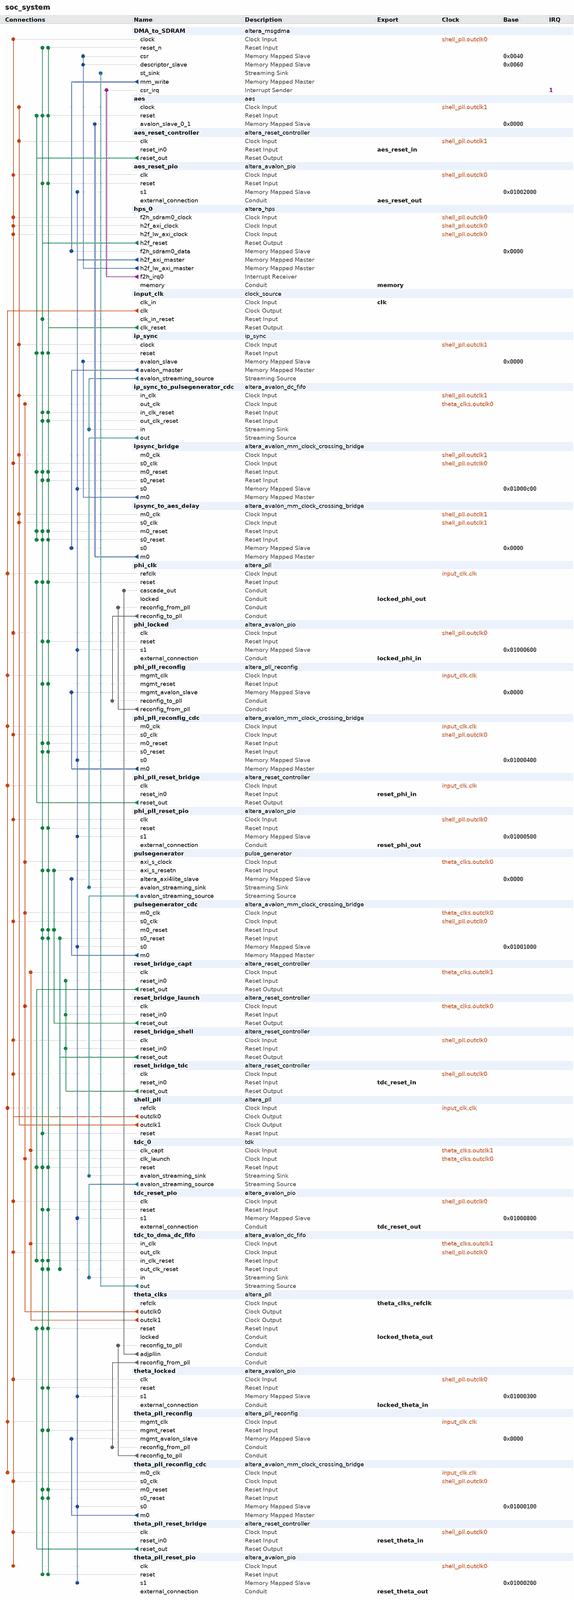
[diagram p0: system contents, whole]
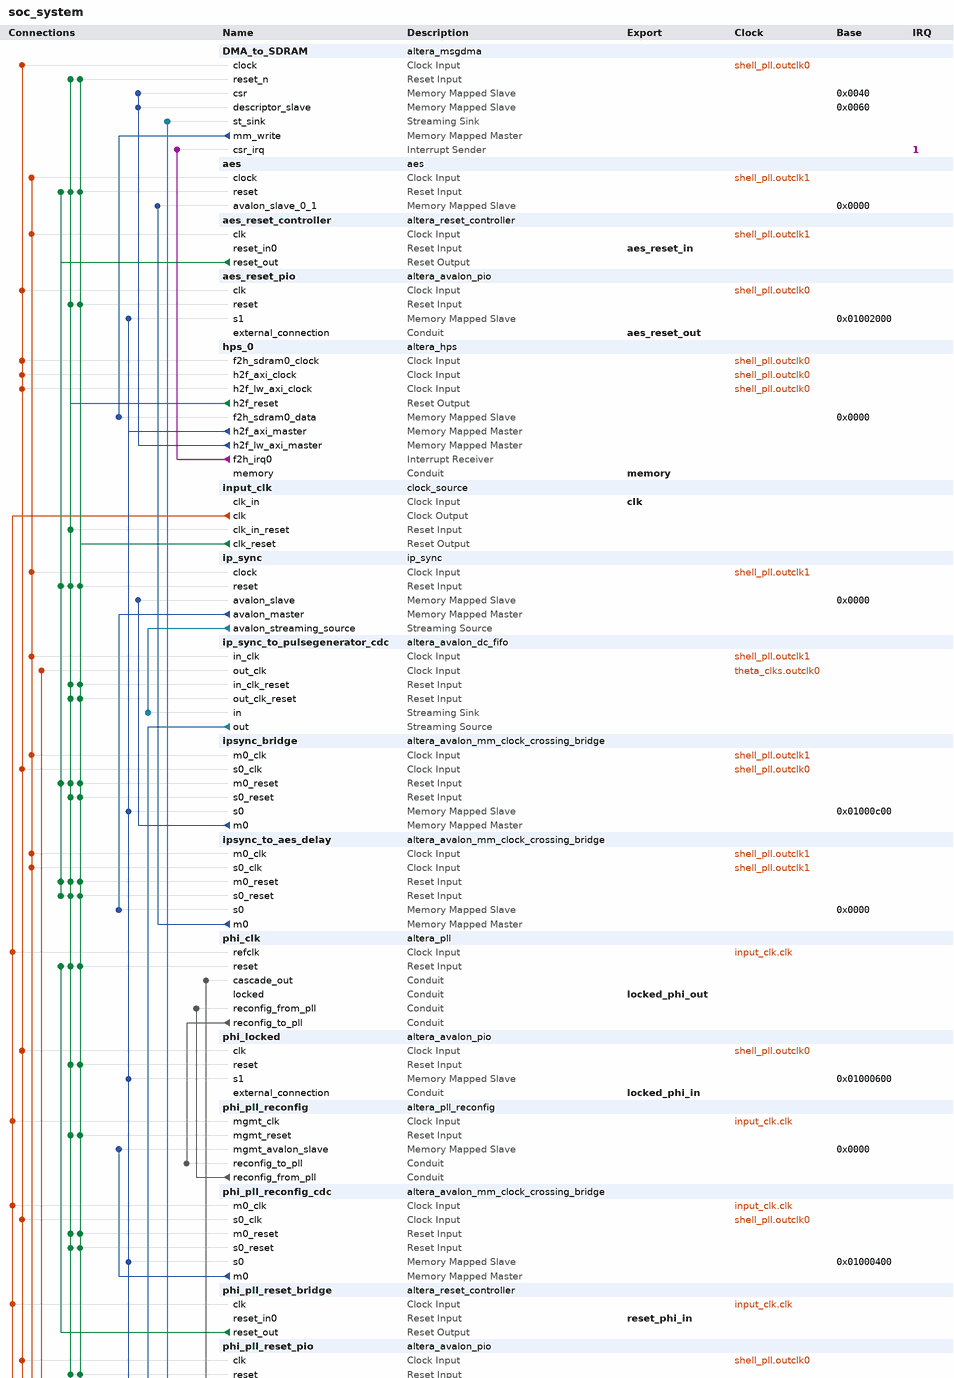
[diagram p1: system contents, upper part]
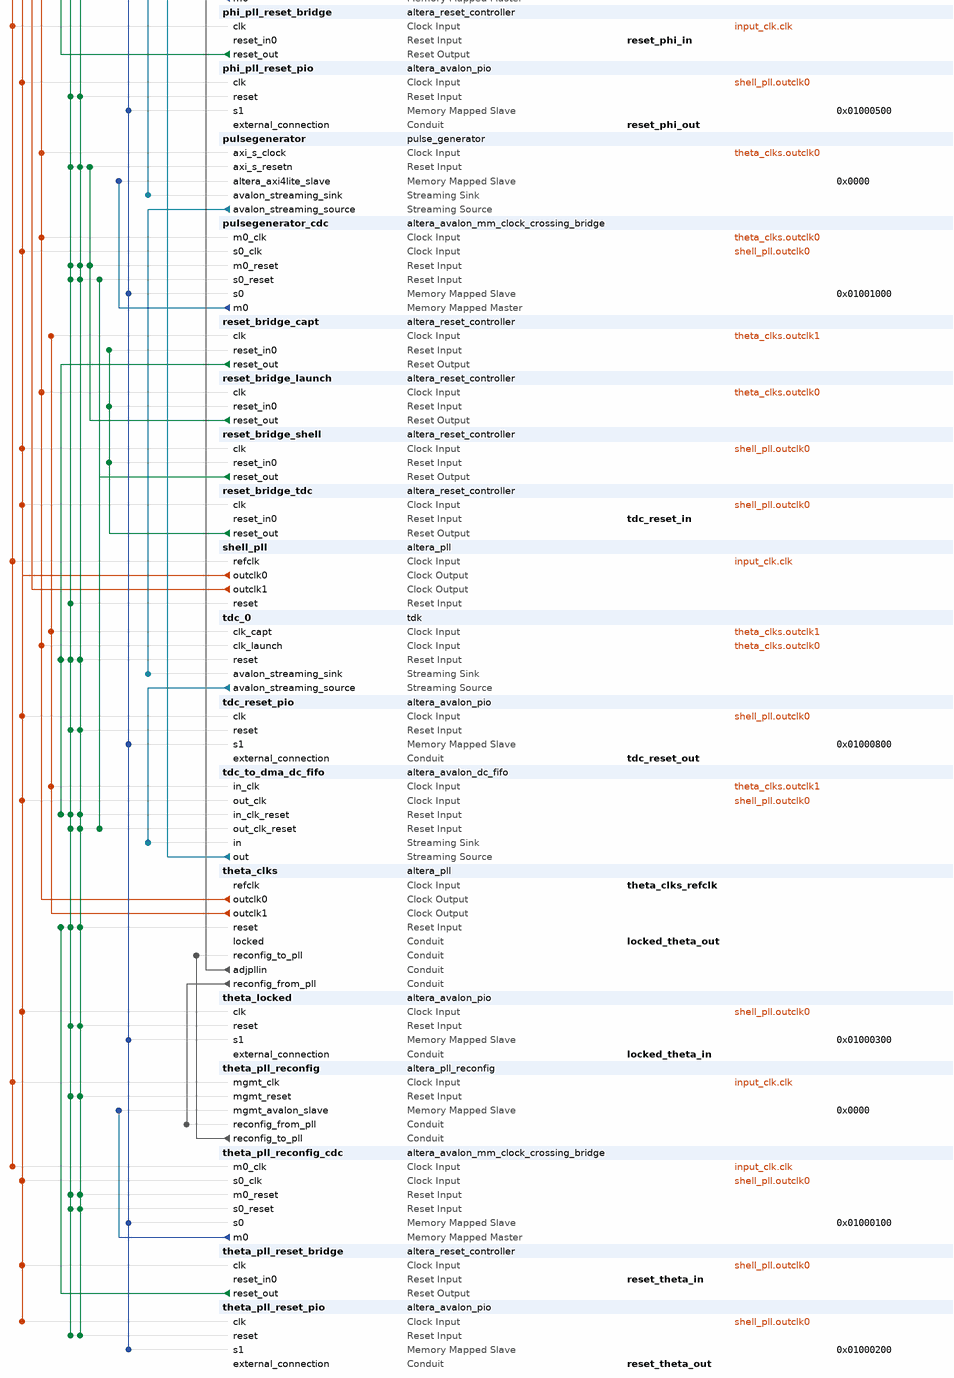
[diagram p2: system contents, lower part]
# Platform Designer (Qsys) system soc_system, Cyclone V 5CSEBA6U23I7
# Parameters at their usual value, and those the tool derives, are not listed.
package require -exact qsys 22.1
create_system soc_system
set_project_property DEVICE_FAMILY {Cyclone V}
set_project_property DEVICE 5CSEBA6U23I7

add_instance DMA_to_SDRAM altera_msgdma 22.1
set_instance_parameter_value DMA_to_SDRAM BURST_ENABLE 1
set_instance_parameter_value DMA_to_SDRAM BURST_WRAPPING_SUPPORT 1
set_instance_parameter_value DMA_to_SDRAM DATA_FIFO_DEPTH 2048
set_instance_parameter_value DMA_to_SDRAM DATA_WIDTH 256
set_instance_parameter_value DMA_to_SDRAM DESCRIPTOR_FIFO_DEPTH 32
set_instance_parameter_value DMA_to_SDRAM ENHANCED_FEATURES 0
set_instance_parameter_value DMA_to_SDRAM ERROR_ENABLE 0
set_instance_parameter_value DMA_to_SDRAM MAX_BURST_COUNT 8
set_instance_parameter_value DMA_to_SDRAM MAX_BYTE 65536
set_instance_parameter_value DMA_to_SDRAM MODE 2
set_instance_parameter_value DMA_to_SDRAM PACKET_ENABLE 0
set_instance_parameter_value DMA_to_SDRAM TRANSFER_TYPE {Full Word Accesses Only}

add_instance aes aes 1.0

add_instance aes_reset_controller altera_reset_controller 22.1
set_instance_parameter_value aes_reset_controller NUM_RESET_INPUTS 1
set_instance_parameter_value aes_reset_controller SYNC_DEPTH 2

add_instance aes_reset_pio altera_avalon_pio 22.1
set_instance_parameter_value aes_reset_pio direction Output
set_instance_parameter_value aes_reset_pio width 32

add_instance hps_0 altera_hps 22.1
set_instance_parameter_value hps_0 EMAC1_Mode N/A
set_instance_parameter_value hps_0 EMAC1_PinMuxing Unused
set_instance_parameter_value hps_0 F2SCLK_COLDRST_Enable false
set_instance_parameter_value hps_0 F2SCLK_DBGRST_Enable false
set_instance_parameter_value hps_0 F2SCLK_WARMRST_Enable false
set_instance_parameter_value hps_0 F2SDRAM_Type {Avalon-MM Write-Only}
set_instance_parameter_value hps_0 F2SDRAM_Width 256
set_instance_parameter_value hps_0 F2SINTERRUPT_Enable true
set_instance_parameter_value hps_0 F2S_Width 0
set_instance_parameter_value hps_0 FPGA_PERIPHERAL_OUTPUT_CLOCK_FREQ_EMAC0_GTX_CLK 100
set_instance_parameter_value hps_0 FPGA_PERIPHERAL_OUTPUT_CLOCK_FREQ_EMAC0_MD_CLK 100.0
set_instance_parameter_value hps_0 FPGA_PERIPHERAL_OUTPUT_CLOCK_FREQ_EMAC1_GTX_CLK 100
set_instance_parameter_value hps_0 FPGA_PERIPHERAL_OUTPUT_CLOCK_FREQ_EMAC1_MD_CLK 100.0
set_instance_parameter_value hps_0 HPS_PROTOCOL DDR3
set_instance_parameter_value hps_0 I2C0_Mode N/A
set_instance_parameter_value hps_0 I2C0_PinMuxing Unused
set_instance_parameter_value hps_0 I2C1_Mode N/A
set_instance_parameter_value hps_0 I2C1_PinMuxing Unused
set_instance_parameter_value hps_0 LWH2F_Enable true
set_instance_parameter_value hps_0 MEM_BANKADDR_WIDTH 3
set_instance_parameter_value hps_0 MEM_CLK_FREQ 400.0
set_instance_parameter_value hps_0 MEM_COL_ADDR_WIDTH 10
set_instance_parameter_value hps_0 MEM_DQ_WIDTH 32
set_instance_parameter_value hps_0 MEM_DRV_STR RZQ/6
set_instance_parameter_value hps_0 MEM_ROW_ADDR_WIDTH 15
set_instance_parameter_value hps_0 MEM_RTT_NOM RZQ/6
set_instance_parameter_value hps_0 MEM_RTT_WR {Dynamic ODT off}
set_instance_parameter_value hps_0 MEM_TCL 7
set_instance_parameter_value hps_0 MEM_TFAW_NS 37.5
set_instance_parameter_value hps_0 MEM_TRAS_NS 35.0
set_instance_parameter_value hps_0 MEM_TRCD_NS 13.75
set_instance_parameter_value hps_0 MEM_TRFC_NS 300.0
set_instance_parameter_value hps_0 MEM_TRP_NS 13.75
set_instance_parameter_value hps_0 MEM_VENDOR Other
set_instance_parameter_value hps_0 MEM_WTCL 7
set_instance_parameter_value hps_0 QSPI_Mode N/A
set_instance_parameter_value hps_0 QSPI_PinMuxing Unused
set_instance_parameter_value hps_0 REF_CLK_FREQ 25.0
set_instance_parameter_value hps_0 S2FCLK_USER2CLK 4
set_instance_parameter_value hps_0 S2F_Width 1
set_instance_parameter_value hps_0 SDIO_Mode N/A
set_instance_parameter_value hps_0 SDIO_PinMuxing Unused
set_instance_parameter_value hps_0 SPIM1_Mode N/A
set_instance_parameter_value hps_0 SPIM1_PinMuxing Unused
set_instance_parameter_value hps_0 STM_Enable false
set_instance_parameter_value hps_0 TIMING_BOARD_AC_SKEW 0.02
set_instance_parameter_value hps_0 TIMING_BOARD_AC_TO_CK_SKEW 0.0
set_instance_parameter_value hps_0 TIMING_BOARD_DQ_TO_DQS_SKEW 0.0
set_instance_parameter_value hps_0 TIMING_BOARD_MAX_CK_DELAY 0.6
set_instance_parameter_value hps_0 TIMING_BOARD_MAX_DQS_DELAY 0.6
set_instance_parameter_value hps_0 TIMING_BOARD_SKEW_BETWEEN_DQS 0.02
set_instance_parameter_value hps_0 TIMING_BOARD_SKEW_CKDQS_DIMM_MAX 0.01
set_instance_parameter_value hps_0 TIMING_BOARD_SKEW_CKDQS_DIMM_MIN -0.01
set_instance_parameter_value hps_0 TIMING_BOARD_SKEW_WITHIN_DQS 0.02
set_instance_parameter_value hps_0 TIMING_TDH 125
set_instance_parameter_value hps_0 TIMING_TDQSCK 400
set_instance_parameter_value hps_0 TIMING_TDQSQ 120
set_instance_parameter_value hps_0 TIMING_TDS 50
set_instance_parameter_value hps_0 TIMING_TIH 250
set_instance_parameter_value hps_0 TIMING_TIS 175
set_instance_parameter_value hps_0 TIMING_TQSH 0.38
set_instance_parameter_value hps_0 UART0_Mode N/A
set_instance_parameter_value hps_0 UART0_PinMuxing Unused
set_instance_parameter_value hps_0 USB1_Mode N/A
set_instance_parameter_value hps_0 USB1_PinMuxing Unused
set_instance_parameter_value hps_0 desired_cfg_clk_mhz 100.0
set_instance_parameter_value hps_0 desired_qspi_clk_mhz 370.0

add_instance input_clk clock_source 22.1
set_instance_parameter_value input_clk clockFrequency 50000000

add_instance ip_sync ip_sync 1.0
set_instance_parameter_value ip_sync ADDR_TRIGGER 8
set_instance_parameter_value ip_sync DATA_TRIGGER 2

add_instance ip_sync_to_pulsegenerator_cdc altera_avalon_dc_fifo 22.1
set_instance_parameter_value ip_sync_to_pulsegenerator_cdc BITS_PER_SYMBOL 8
set_instance_parameter_value ip_sync_to_pulsegenerator_cdc FIFO_DEPTH 16
set_instance_parameter_value ip_sync_to_pulsegenerator_cdc RD_SYNC_DEPTH 8
set_instance_parameter_value ip_sync_to_pulsegenerator_cdc USE_PACKETS 0
set_instance_parameter_value ip_sync_to_pulsegenerator_cdc WR_SYNC_DEPTH 8

add_instance ipsync_bridge altera_avalon_mm_clock_crossing_bridge 22.1
set_instance_parameter_value ipsync_bridge ADDRESS_WIDTH 10
set_instance_parameter_value ipsync_bridge COMMAND_FIFO_DEPTH 8
set_instance_parameter_value ipsync_bridge DATA_WIDTH 32
set_instance_parameter_value ipsync_bridge MASTER_SYNC_DEPTH 8
set_instance_parameter_value ipsync_bridge MAX_BURST_SIZE 1
set_instance_parameter_value ipsync_bridge RESPONSE_FIFO_DEPTH 8
set_instance_parameter_value ipsync_bridge SLAVE_SYNC_DEPTH 8
set_instance_parameter_value ipsync_bridge USE_AUTO_ADDRESS_WIDTH 1

add_instance ipsync_to_aes_delay altera_avalon_mm_clock_crossing_bridge 22.1
set_instance_parameter_value ipsync_to_aes_delay ADDRESS_WIDTH 10
set_instance_parameter_value ipsync_to_aes_delay COMMAND_FIFO_DEPTH 8
set_instance_parameter_value ipsync_to_aes_delay DATA_WIDTH 32
set_instance_parameter_value ipsync_to_aes_delay MASTER_SYNC_DEPTH 16
set_instance_parameter_value ipsync_to_aes_delay MAX_BURST_SIZE 1
set_instance_parameter_value ipsync_to_aes_delay RESPONSE_FIFO_DEPTH 8
set_instance_parameter_value ipsync_to_aes_delay SLAVE_SYNC_DEPTH 16
set_instance_parameter_value ipsync_to_aes_delay USE_AUTO_ADDRESS_WIDTH 0

add_instance phi_clk altera_pll 22.1
set_instance_parameter_value phi_clk gui_actual_phase_shift0 {0 ps}
set_instance_parameter_value phi_clk gui_device_speed_grade 2
set_instance_parameter_value phi_clk gui_en_adv_params true
set_instance_parameter_value phi_clk gui_en_reconf true
set_instance_parameter_value phi_clk gui_enable_cascade_out true
set_instance_parameter_value phi_clk gui_fractional_cout 8
set_instance_parameter_value phi_clk gui_number_of_clocks 1
set_instance_parameter_value phi_clk gui_operation_mode direct
set_instance_parameter_value phi_clk gui_output_clock_frequency0 300.0
set_instance_parameter_value phi_clk gui_pll_bandwidth_preset Low
set_instance_parameter_value phi_clk gui_pll_mode {Integer-N PLL}
set_instance_parameter_value phi_clk gui_reference_clock_frequency 50.0
set_instance_parameter_value phi_clk gui_use_locked true

add_instance phi_locked altera_avalon_pio 22.1
set_instance_parameter_value phi_locked direction Input
set_instance_parameter_value phi_locked width 32

add_instance phi_pll_reconfig altera_pll_reconfig 22.1

add_instance phi_pll_reconfig_cdc altera_avalon_mm_clock_crossing_bridge 22.1
set_instance_parameter_value phi_pll_reconfig_cdc ADDRESS_WIDTH 6
set_instance_parameter_value phi_pll_reconfig_cdc COMMAND_FIFO_DEPTH 8
set_instance_parameter_value phi_pll_reconfig_cdc DATA_WIDTH 32
set_instance_parameter_value phi_pll_reconfig_cdc MASTER_SYNC_DEPTH 8
set_instance_parameter_value phi_pll_reconfig_cdc MAX_BURST_SIZE 1
set_instance_parameter_value phi_pll_reconfig_cdc RESPONSE_FIFO_DEPTH 8
set_instance_parameter_value phi_pll_reconfig_cdc SLAVE_SYNC_DEPTH 8
set_instance_parameter_value phi_pll_reconfig_cdc USE_AUTO_ADDRESS_WIDTH 1

add_instance phi_pll_reset_bridge altera_reset_controller 22.1
set_instance_parameter_value phi_pll_reset_bridge NUM_RESET_INPUTS 1
set_instance_parameter_value phi_pll_reset_bridge SYNC_DEPTH 2

add_instance phi_pll_reset_pio altera_avalon_pio 22.1
set_instance_parameter_value phi_pll_reset_pio direction Output
set_instance_parameter_value phi_pll_reset_pio width 32

add_instance pulsegenerator pulse_generator 1.0
set_instance_parameter_value pulsegenerator C_SELECT_BIT 1
set_instance_parameter_value pulsegenerator PIPELINE_OUTPUT 4

add_instance pulsegenerator_cdc altera_avalon_mm_clock_crossing_bridge 22.1
set_instance_parameter_value pulsegenerator_cdc ADDRESS_WIDTH 12
set_instance_parameter_value pulsegenerator_cdc COMMAND_FIFO_DEPTH 8
set_instance_parameter_value pulsegenerator_cdc DATA_WIDTH 32
set_instance_parameter_value pulsegenerator_cdc MASTER_SYNC_DEPTH 8
set_instance_parameter_value pulsegenerator_cdc MAX_BURST_SIZE 1
set_instance_parameter_value pulsegenerator_cdc RESPONSE_FIFO_DEPTH 8
set_instance_parameter_value pulsegenerator_cdc SLAVE_SYNC_DEPTH 8
set_instance_parameter_value pulsegenerator_cdc USE_AUTO_ADDRESS_WIDTH 1

add_instance reset_bridge_capt altera_reset_controller 22.1
set_instance_parameter_value reset_bridge_capt NUM_RESET_INPUTS 1
set_instance_parameter_value reset_bridge_capt SYNC_DEPTH 2

add_instance reset_bridge_launch altera_reset_controller 22.1
set_instance_parameter_value reset_bridge_launch NUM_RESET_INPUTS 1
set_instance_parameter_value reset_bridge_launch SYNC_DEPTH 2

add_instance reset_bridge_shell altera_reset_controller 22.1
set_instance_parameter_value reset_bridge_shell NUM_RESET_INPUTS 1
set_instance_parameter_value reset_bridge_shell SYNC_DEPTH 2

add_instance reset_bridge_tdc altera_reset_controller 22.1
set_instance_parameter_value reset_bridge_tdc NUM_RESET_INPUTS 1
set_instance_parameter_value reset_bridge_tdc SYNC_DEPTH 2

add_instance shell_pll altera_pll 22.1
set_instance_parameter_value shell_pll gui_device_speed_grade 2
set_instance_parameter_value shell_pll gui_en_adv_params true
set_instance_parameter_value shell_pll gui_number_of_clocks 2
set_instance_parameter_value shell_pll gui_operation_mode direct
set_instance_parameter_value shell_pll gui_output_clock_frequency0 100.0
set_instance_parameter_value shell_pll gui_output_clock_frequency1 25.0
set_instance_parameter_value shell_pll gui_pll_mode {Integer-N PLL}
set_instance_parameter_value shell_pll gui_reference_clock_frequency 50.0
set_instance_parameter_value shell_pll gui_use_locked false

add_instance tdc_0 tdk 1.0
set_instance_parameter_value tdc_0 C_OUT_WIDTH 128
set_instance_parameter_value tdc_0 C_SYNC_DEPTH 4
set_instance_parameter_value tdc_0 REVERSE 1
set_instance_parameter_value tdc_0 TECHNOLOGY 28nm

add_instance tdc_reset_pio altera_avalon_pio 22.1
set_instance_parameter_value tdc_reset_pio direction Output
set_instance_parameter_value tdc_reset_pio width 32

add_instance tdc_to_dma_dc_fifo altera_avalon_dc_fifo 22.1
set_instance_parameter_value tdc_to_dma_dc_fifo BITS_PER_SYMBOL 8
set_instance_parameter_value tdc_to_dma_dc_fifo FIFO_DEPTH 16
set_instance_parameter_value tdc_to_dma_dc_fifo RD_SYNC_DEPTH 8
set_instance_parameter_value tdc_to_dma_dc_fifo SYMBOLS_PER_BEAT 32
set_instance_parameter_value tdc_to_dma_dc_fifo USE_PACKETS 0
set_instance_parameter_value tdc_to_dma_dc_fifo WR_SYNC_DEPTH 8

add_instance theta_clks altera_pll 22.1
set_instance_parameter_value theta_clks gui_actual_phase_shift0 {0 ps}
set_instance_parameter_value theta_clks gui_actual_phase_shift1 {0 ps}
set_instance_parameter_value theta_clks gui_device_speed_grade 2
set_instance_parameter_value theta_clks gui_en_adv_params true
set_instance_parameter_value theta_clks gui_en_reconf true
set_instance_parameter_value theta_clks gui_enable_cascade_in true
set_instance_parameter_value theta_clks gui_fractional_cout 8
set_instance_parameter_value theta_clks gui_number_of_clocks 2
set_instance_parameter_value theta_clks gui_operation_mode normal
set_instance_parameter_value theta_clks gui_output_clock_frequency0 300.0
set_instance_parameter_value theta_clks gui_output_clock_frequency1 100.0
set_instance_parameter_value theta_clks gui_pll_bandwidth_preset High
set_instance_parameter_value theta_clks gui_pll_mode {Integer-N PLL}
set_instance_parameter_value theta_clks gui_reference_clock_frequency 50.0
set_instance_parameter_value theta_clks gui_use_locked true

add_instance theta_locked altera_avalon_pio 22.1
set_instance_parameter_value theta_locked direction Input
set_instance_parameter_value theta_locked width 32

add_instance theta_pll_reconfig altera_pll_reconfig 22.1

add_instance theta_pll_reconfig_cdc altera_avalon_mm_clock_crossing_bridge 22.1
set_instance_parameter_value theta_pll_reconfig_cdc ADDRESS_WIDTH 6
set_instance_parameter_value theta_pll_reconfig_cdc COMMAND_FIFO_DEPTH 8
set_instance_parameter_value theta_pll_reconfig_cdc DATA_WIDTH 32
set_instance_parameter_value theta_pll_reconfig_cdc MASTER_SYNC_DEPTH 8
set_instance_parameter_value theta_pll_reconfig_cdc MAX_BURST_SIZE 1
set_instance_parameter_value theta_pll_reconfig_cdc RESPONSE_FIFO_DEPTH 8
set_instance_parameter_value theta_pll_reconfig_cdc SLAVE_SYNC_DEPTH 8
set_instance_parameter_value theta_pll_reconfig_cdc USE_AUTO_ADDRESS_WIDTH 1

add_instance theta_pll_reset_bridge altera_reset_controller 22.1
set_instance_parameter_value theta_pll_reset_bridge NUM_RESET_INPUTS 1
set_instance_parameter_value theta_pll_reset_bridge SYNC_DEPTH 2

add_instance theta_pll_reset_pio altera_avalon_pio 22.1
set_instance_parameter_value theta_pll_reset_pio direction Output
set_instance_parameter_value theta_pll_reset_pio width 32

# connections
add_connection input_clk.clk phi_clk.refclk clock
add_connection input_clk.clk phi_pll_reconfig.mgmt_clk clock
add_connection input_clk.clk phi_pll_reconfig_cdc.m0_clk clock
add_connection input_clk.clk phi_pll_reset_bridge.clk clock
add_connection input_clk.clk shell_pll.refclk clock
add_connection input_clk.clk theta_pll_reconfig.mgmt_clk clock
add_connection input_clk.clk theta_pll_reconfig_cdc.m0_clk clock
add_connection shell_pll.outclk0 aes_reset_pio.clk clock
add_connection shell_pll.outclk0 DMA_to_SDRAM.clock clock
add_connection shell_pll.outclk0 hps_0.f2h_sdram0_clock clock
add_connection shell_pll.outclk0 hps_0.h2f_axi_clock clock
add_connection shell_pll.outclk0 hps_0.h2f_lw_axi_clock clock
add_connection shell_pll.outclk0 ipsync_bridge.s0_clk clock
add_connection shell_pll.outclk0 phi_locked.clk clock
add_connection shell_pll.outclk0 phi_pll_reconfig_cdc.s0_clk clock
add_connection shell_pll.outclk0 phi_pll_reset_pio.clk clock
add_connection shell_pll.outclk0 pulsegenerator_cdc.s0_clk clock
add_connection shell_pll.outclk0 reset_bridge_shell.clk clock
add_connection shell_pll.outclk0 reset_bridge_tdc.clk clock
add_connection shell_pll.outclk0 tdc_reset_pio.clk clock
add_connection shell_pll.outclk0 tdc_to_dma_dc_fifo.out_clk clock
add_connection shell_pll.outclk0 theta_locked.clk clock
add_connection shell_pll.outclk0 theta_pll_reconfig_cdc.s0_clk clock
add_connection shell_pll.outclk0 theta_pll_reset_bridge.clk clock
add_connection shell_pll.outclk0 theta_pll_reset_pio.clk clock
add_connection shell_pll.outclk1 aes.clock clock
add_connection shell_pll.outclk1 aes_reset_controller.clk clock
add_connection shell_pll.outclk1 ip_sync.clock clock
add_connection shell_pll.outclk1 ip_sync_to_pulsegenerator_cdc.in_clk clock
add_connection shell_pll.outclk1 ipsync_bridge.m0_clk clock
add_connection shell_pll.outclk1 ipsync_to_aes_delay.m0_clk clock
add_connection shell_pll.outclk1 ipsync_to_aes_delay.s0_clk clock
add_connection theta_clks.outclk0 ip_sync_to_pulsegenerator_cdc.out_clk clock
add_connection theta_clks.outclk0 pulsegenerator.axi_s_clock clock
add_connection theta_clks.outclk0 pulsegenerator_cdc.m0_clk clock
add_connection theta_clks.outclk0 reset_bridge_launch.clk clock
add_connection theta_clks.outclk0 tdc_0.clk_launch clock
add_connection theta_clks.outclk1 reset_bridge_capt.clk clock
add_connection theta_clks.outclk1 tdc_0.clk_capt clock
add_connection theta_clks.outclk1 tdc_to_dma_dc_fifo.in_clk clock
add_connection aes_reset_controller.reset_out aes.reset reset
add_connection aes_reset_controller.reset_out ip_sync.reset reset
add_connection aes_reset_controller.reset_out ipsync_bridge.m0_reset reset
add_connection aes_reset_controller.reset_out ipsync_to_aes_delay.m0_reset reset
add_connection aes_reset_controller.reset_out ipsync_to_aes_delay.s0_reset reset
add_connection hps_0.h2f_reset aes.reset reset
add_connection hps_0.h2f_reset aes_reset_pio.reset reset
add_connection hps_0.h2f_reset DMA_to_SDRAM.reset_n reset
add_connection hps_0.h2f_reset input_clk.clk_in_reset reset
add_connection hps_0.h2f_reset ip_sync.reset reset
add_connection hps_0.h2f_reset ip_sync_to_pulsegenerator_cdc.in_clk_reset reset
add_connection hps_0.h2f_reset ip_sync_to_pulsegenerator_cdc.out_clk_reset reset
add_connection hps_0.h2f_reset ipsync_bridge.m0_reset reset
add_connection hps_0.h2f_reset ipsync_bridge.s0_reset reset
add_connection hps_0.h2f_reset ipsync_to_aes_delay.m0_reset reset
add_connection hps_0.h2f_reset ipsync_to_aes_delay.s0_reset reset
add_connection hps_0.h2f_reset phi_clk.reset reset
add_connection hps_0.h2f_reset phi_locked.reset reset
add_connection hps_0.h2f_reset phi_pll_reconfig.mgmt_reset reset
add_connection hps_0.h2f_reset phi_pll_reconfig_cdc.m0_reset reset
add_connection hps_0.h2f_reset phi_pll_reconfig_cdc.s0_reset reset
add_connection hps_0.h2f_reset phi_pll_reset_pio.reset reset
add_connection hps_0.h2f_reset pulsegenerator.axi_s_resetn reset
add_connection hps_0.h2f_reset pulsegenerator_cdc.m0_reset reset
add_connection hps_0.h2f_reset pulsegenerator_cdc.s0_reset reset
add_connection hps_0.h2f_reset shell_pll.reset reset
add_connection hps_0.h2f_reset tdc_0.reset reset
add_connection hps_0.h2f_reset tdc_reset_pio.reset reset
add_connection hps_0.h2f_reset tdc_to_dma_dc_fifo.in_clk_reset reset
add_connection hps_0.h2f_reset tdc_to_dma_dc_fifo.out_clk_reset reset
add_connection hps_0.h2f_reset theta_clks.reset reset
add_connection hps_0.h2f_reset theta_locked.reset reset
add_connection hps_0.h2f_reset theta_pll_reconfig.mgmt_reset reset
add_connection hps_0.h2f_reset theta_pll_reconfig_cdc.m0_reset reset
add_connection hps_0.h2f_reset theta_pll_reconfig_cdc.s0_reset reset
add_connection hps_0.h2f_reset theta_pll_reset_pio.reset reset
add_connection input_clk.clk_reset aes.reset reset
add_connection input_clk.clk_reset aes_reset_pio.reset reset
add_connection input_clk.clk_reset DMA_to_SDRAM.reset_n reset
add_connection input_clk.clk_reset ip_sync.reset reset
add_connection input_clk.clk_reset ip_sync_to_pulsegenerator_cdc.in_clk_reset reset
add_connection input_clk.clk_reset ip_sync_to_pulsegenerator_cdc.out_clk_reset reset
add_connection input_clk.clk_reset ipsync_bridge.m0_reset reset
add_connection input_clk.clk_reset ipsync_bridge.s0_reset reset
add_connection input_clk.clk_reset ipsync_to_aes_delay.m0_reset reset
add_connection input_clk.clk_reset ipsync_to_aes_delay.s0_reset reset
add_connection input_clk.clk_reset phi_clk.reset reset
add_connection input_clk.clk_reset phi_locked.reset reset
add_connection input_clk.clk_reset phi_pll_reconfig.mgmt_reset reset
add_connection input_clk.clk_reset phi_pll_reconfig_cdc.m0_reset reset
add_connection input_clk.clk_reset phi_pll_reconfig_cdc.s0_reset reset
add_connection input_clk.clk_reset phi_pll_reset_pio.reset reset
add_connection input_clk.clk_reset pulsegenerator.axi_s_resetn reset
add_connection input_clk.clk_reset pulsegenerator_cdc.m0_reset reset
add_connection input_clk.clk_reset pulsegenerator_cdc.s0_reset reset
add_connection input_clk.clk_reset tdc_0.reset reset
add_connection input_clk.clk_reset tdc_reset_pio.reset reset
add_connection input_clk.clk_reset tdc_to_dma_dc_fifo.in_clk_reset reset
add_connection input_clk.clk_reset tdc_to_dma_dc_fifo.out_clk_reset reset
add_connection input_clk.clk_reset theta_clks.reset reset
add_connection input_clk.clk_reset theta_locked.reset reset
add_connection input_clk.clk_reset theta_pll_reconfig.mgmt_reset reset
add_connection input_clk.clk_reset theta_pll_reconfig_cdc.m0_reset reset
add_connection input_clk.clk_reset theta_pll_reconfig_cdc.s0_reset reset
add_connection input_clk.clk_reset theta_pll_reset_pio.reset reset
add_connection phi_pll_reset_bridge.reset_out phi_clk.reset reset
add_connection reset_bridge_capt.reset_out tdc_0.reset reset
add_connection reset_bridge_capt.reset_out tdc_to_dma_dc_fifo.in_clk_reset reset
add_connection reset_bridge_launch.reset_out pulsegenerator.axi_s_resetn reset
add_connection reset_bridge_launch.reset_out pulsegenerator_cdc.m0_reset reset
add_connection reset_bridge_shell.reset_out pulsegenerator_cdc.s0_reset reset
add_connection reset_bridge_shell.reset_out tdc_to_dma_dc_fifo.out_clk_reset reset
add_connection reset_bridge_tdc.reset_out reset_bridge_capt.reset_in0 reset
add_connection reset_bridge_tdc.reset_out reset_bridge_launch.reset_in0 reset
add_connection reset_bridge_tdc.reset_out reset_bridge_shell.reset_in0 reset
add_connection theta_pll_reset_bridge.reset_out theta_clks.reset reset
add_connection DMA_to_SDRAM.mm_write hps_0.f2h_sdram0_data avalon
set_connection_parameter_value DMA_to_SDRAM.mm_write/hps_0.f2h_sdram0_data baseAddress 0x0000
add_connection hps_0.h2f_axi_master aes_reset_pio.s1 avalon
set_connection_parameter_value hps_0.h2f_axi_master/aes_reset_pio.s1 baseAddress 0x01002000
add_connection hps_0.h2f_axi_master ipsync_bridge.s0 avalon
set_connection_parameter_value hps_0.h2f_axi_master/ipsync_bridge.s0 baseAddress 0x01000c00
add_connection hps_0.h2f_axi_master phi_locked.s1 avalon
set_connection_parameter_value hps_0.h2f_axi_master/phi_locked.s1 baseAddress 0x01000600
add_connection hps_0.h2f_axi_master phi_pll_reconfig_cdc.s0 avalon
set_connection_parameter_value hps_0.h2f_axi_master/phi_pll_reconfig_cdc.s0 baseAddress 0x01000400
add_connection hps_0.h2f_axi_master phi_pll_reset_pio.s1 avalon
set_connection_parameter_value hps_0.h2f_axi_master/phi_pll_reset_pio.s1 baseAddress 0x01000500
add_connection hps_0.h2f_axi_master pulsegenerator_cdc.s0 avalon
set_connection_parameter_value hps_0.h2f_axi_master/pulsegenerator_cdc.s0 baseAddress 0x01001000
add_connection hps_0.h2f_axi_master tdc_reset_pio.s1 avalon
set_connection_parameter_value hps_0.h2f_axi_master/tdc_reset_pio.s1 baseAddress 0x01000800
add_connection hps_0.h2f_axi_master theta_locked.s1 avalon
set_connection_parameter_value hps_0.h2f_axi_master/theta_locked.s1 baseAddress 0x01000300
add_connection hps_0.h2f_axi_master theta_pll_reconfig_cdc.s0 avalon
set_connection_parameter_value hps_0.h2f_axi_master/theta_pll_reconfig_cdc.s0 baseAddress 0x01000100
add_connection hps_0.h2f_axi_master theta_pll_reset_pio.s1 avalon
set_connection_parameter_value hps_0.h2f_axi_master/theta_pll_reset_pio.s1 baseAddress 0x01000200
add_connection hps_0.h2f_lw_axi_master DMA_to_SDRAM.csr avalon
set_connection_parameter_value hps_0.h2f_lw_axi_master/DMA_to_SDRAM.csr baseAddress 0x0040
add_connection hps_0.h2f_lw_axi_master DMA_to_SDRAM.descriptor_slave avalon
set_connection_parameter_value hps_0.h2f_lw_axi_master/DMA_to_SDRAM.descriptor_slave baseAddress 0x0060
add_connection ip_sync.avalon_master ipsync_to_aes_delay.s0 avalon
set_connection_parameter_value ip_sync.avalon_master/ipsync_to_aes_delay.s0 baseAddress 0x0000
add_connection ipsync_bridge.m0 ip_sync.avalon_slave avalon
set_connection_parameter_value ipsync_bridge.m0/ip_sync.avalon_slave baseAddress 0x0000
add_connection ipsync_to_aes_delay.m0 aes.avalon_slave_0_1 avalon
set_connection_parameter_value ipsync_to_aes_delay.m0/aes.avalon_slave_0_1 baseAddress 0x0000
add_connection phi_pll_reconfig_cdc.m0 phi_pll_reconfig.mgmt_avalon_slave avalon
set_connection_parameter_value phi_pll_reconfig_cdc.m0/phi_pll_reconfig.mgmt_avalon_slave baseAddress 0x0000
add_connection pulsegenerator_cdc.m0 pulsegenerator.altera_axi4lite_slave avalon
set_connection_parameter_value pulsegenerator_cdc.m0/pulsegenerator.altera_axi4lite_slave baseAddress 0x0000
add_connection theta_pll_reconfig_cdc.m0 theta_pll_reconfig.mgmt_avalon_slave avalon
set_connection_parameter_value theta_pll_reconfig_cdc.m0/theta_pll_reconfig.mgmt_avalon_slave baseAddress 0x0000
add_connection ip_sync.avalon_streaming_source ip_sync_to_pulsegenerator_cdc.in avalon_streaming
add_connection ip_sync_to_pulsegenerator_cdc.out pulsegenerator.avalon_streaming_sink avalon_streaming
add_connection pulsegenerator.avalon_streaming_source tdc_0.avalon_streaming_sink avalon_streaming
add_connection tdc_0.avalon_streaming_source tdc_to_dma_dc_fifo.in avalon_streaming
add_connection tdc_to_dma_dc_fifo.out DMA_to_SDRAM.st_sink avalon_streaming
add_connection phi_clk.reconfig_to_pll phi_pll_reconfig.reconfig_to_pll conduit
add_connection phi_pll_reconfig.reconfig_from_pll phi_clk.reconfig_from_pll conduit
add_connection theta_clks.adjpllin phi_clk.cascade_out conduit
add_connection theta_clks.reconfig_from_pll theta_pll_reconfig.reconfig_from_pll conduit
add_connection theta_pll_reconfig.reconfig_to_pll theta_clks.reconfig_to_pll conduit
add_connection hps_0.f2h_irq0 DMA_to_SDRAM.csr_irq interrupt
set_connection_parameter_value hps_0.f2h_irq0/DMA_to_SDRAM.csr_irq irqNumber 1

# exported interfaces
add_interface aes_reset_in reset sink
set_interface_property aes_reset_in EXPORT_OF aes_reset_controller.reset_in0
add_interface aes_reset_out conduit end
set_interface_property aes_reset_out EXPORT_OF aes_reset_pio.external_connection
add_interface clk clock sink
set_interface_property clk EXPORT_OF input_clk.clk_in
add_interface locked_phi_in conduit end
set_interface_property locked_phi_in EXPORT_OF phi_locked.external_connection
add_interface locked_phi_out conduit end
set_interface_property locked_phi_out EXPORT_OF phi_clk.locked
add_interface locked_theta_in conduit end
set_interface_property locked_theta_in EXPORT_OF theta_locked.external_connection
add_interface locked_theta_out conduit end
set_interface_property locked_theta_out EXPORT_OF theta_clks.locked
add_interface memory conduit end
set_interface_property memory EXPORT_OF hps_0.memory
add_interface reset_phi_in reset sink
set_interface_property reset_phi_in EXPORT_OF phi_pll_reset_bridge.reset_in0
add_interface reset_phi_out conduit end
set_interface_property reset_phi_out EXPORT_OF phi_pll_reset_pio.external_connection
add_interface reset_theta_in reset sink
set_interface_property reset_theta_in EXPORT_OF theta_pll_reset_bridge.reset_in0
add_interface reset_theta_out conduit end
set_interface_property reset_theta_out EXPORT_OF theta_pll_reset_pio.external_connection
add_interface tdc_reset_in reset sink
set_interface_property tdc_reset_in EXPORT_OF reset_bridge_tdc.reset_in0
add_interface tdc_reset_out conduit end
set_interface_property tdc_reset_out EXPORT_OF tdc_reset_pio.external_connection
add_interface theta_clks_refclk clock sink
set_interface_property theta_clks_refclk EXPORT_OF theta_clks.refclk

set_interconnect_requirement {$system} qsys_mm.clockCrossingAdapter HANDSHAKE
set_interconnect_requirement {$system} qsys_mm.enableEccProtection FALSE
set_interconnect_requirement {$system} qsys_mm.insertDefaultSlave FALSE
set_interconnect_requirement {$system} qsys_mm.maxAdditionalLatency 1

save_system soc_system.qsys
